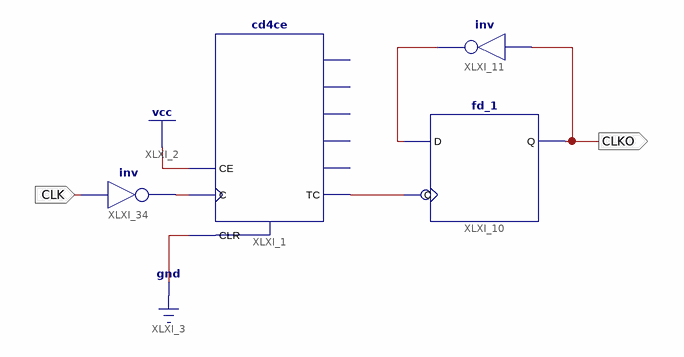
[diagram p0: schematic sheet 1]
// Xilinx ISE schematic clkdiv20.sch (spartan6) as structural Verilog: 4 symbols, 2 ports
module clkdiv20 (
  input  CLK,
  output CLKO
);

  wire CLK_I, XLXN_10, XLXN_11;

  cd4ce XLXI_1 (.C(CLK_I), .CE(1'b1), .CLR(1'b0), .TC(XLXN_10));  // open: CEO, Q0, Q1, Q2, Q3
  fd_1 XLXI_10 (.C(XLXN_10), .D(XLXN_11), .Q(CLKO));
  not XLXI_11 (XLXN_11, CLKO);
  not XLXI_34 (CLK_I, CLK);
endmodule
